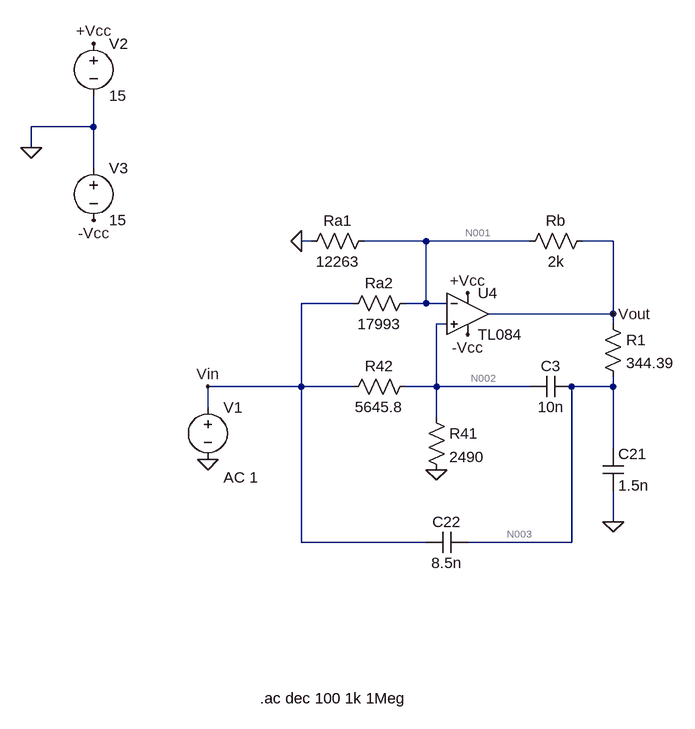
[diagram p0: schematic Sedra_etapa2.asc]
* Sedra_etapa2.asc
V1 Vin 0 AC 1
R42 N002 Vin 5645.8
Ra2 N001 Vin 17993
R41 N002 0 2490
C3 N003 N002 10n
C22 N003 Vin 8.5n
Ra1 N001 0 12263
Rb Vout N001 2k
C21 N003 0 1.5n
V2 +Vcc 0 15
V3 0 -Vcc 15
R1 Vout N003 344.39
* U4: TL084 (symbol sympropio\TL084 not available, pins judged from their places): In+=N002 In-=N001 V+=+Vcc V-=-Vcc OUT=Vout
.ac dec 100 1k 1Meg
.backanno
.end

* Results of the author's LTspice run, read from the files saved beside the schematic
* Operating Point, zero values left out:
*   V(n002) = -77.85 nV
*   V(n001) = 10.89 µV
*   V(n003) = 13.97 µV
*   V(vout) = 13.97 µV
*   V(+vcc) = 15 V
*   V(-vcc) = -15 V
*   I(Rb) = 1.539 nA
*   I(Ra1) = 888.3 pA
*   I(R41) = -31.26 pA
*   I(Ra2) = 605.4 pA
*   I(R42) = -13.79 pA
*   I(V3) = -14.19 mA
*   I(V2) = -14.19 mA
*   I(V1) = 591.6 pA
*   Ix(u4:1) = 45.05 pA
*   Ix(u4:2) = 45.05 pA
*   Ix(u4:3) = 14.19 mA
*   Ix(u4:4) = -14.19 mA
*   Ix(u4:5) = -1.539 nA
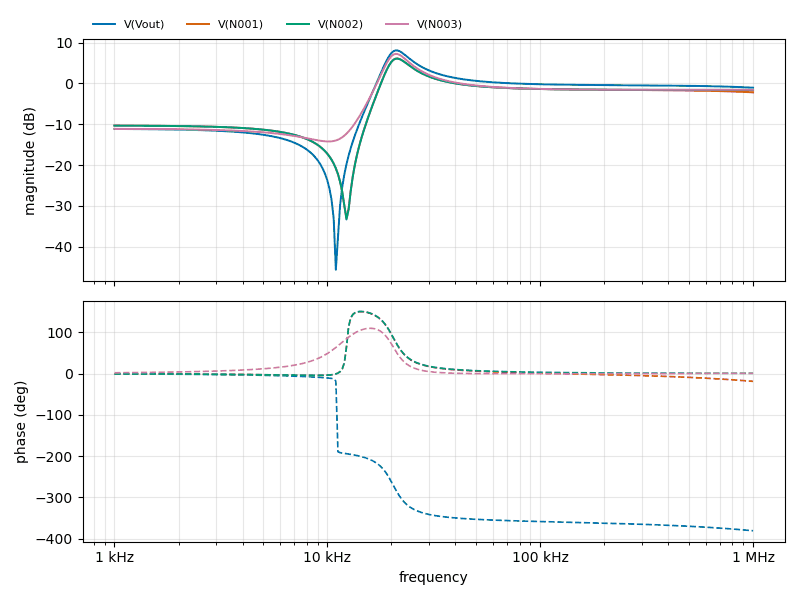
[diagram p1: AC Analysis of Sedra_etapa2.asc, plotted from the saved traces]
* AC Analysis, 1 run:
*   V(Vout): -11.14 dB at 1 kHz, -1.04 dB at 1 MHz, peak 8.09 dB at 20.89 kHz, 3 dB below the peak at 18.77 kHz and 25.79 kHz
*   V(N001): -10.32 dB at 1 kHz, -2.18 dB at 1 MHz, peak 6.11 dB at 21.38 kHz, 3 dB below the peak at 18.92 kHz and 26.43 kHz
*   V(N002): -10.32 dB at 1 kHz, -1.57 dB at 1 MHz, peak 6.10 dB at 21.38 kHz, 3 dB below the peak at 18.92 kHz and 26.43 kHz
*   V(N003): -11.13 dB at 1 kHz, -1.57 dB at 1 MHz, peak 7.25 dB at 20.89 kHz, 3 dB below the peak at 18.68 kHz and 25.51 kHz